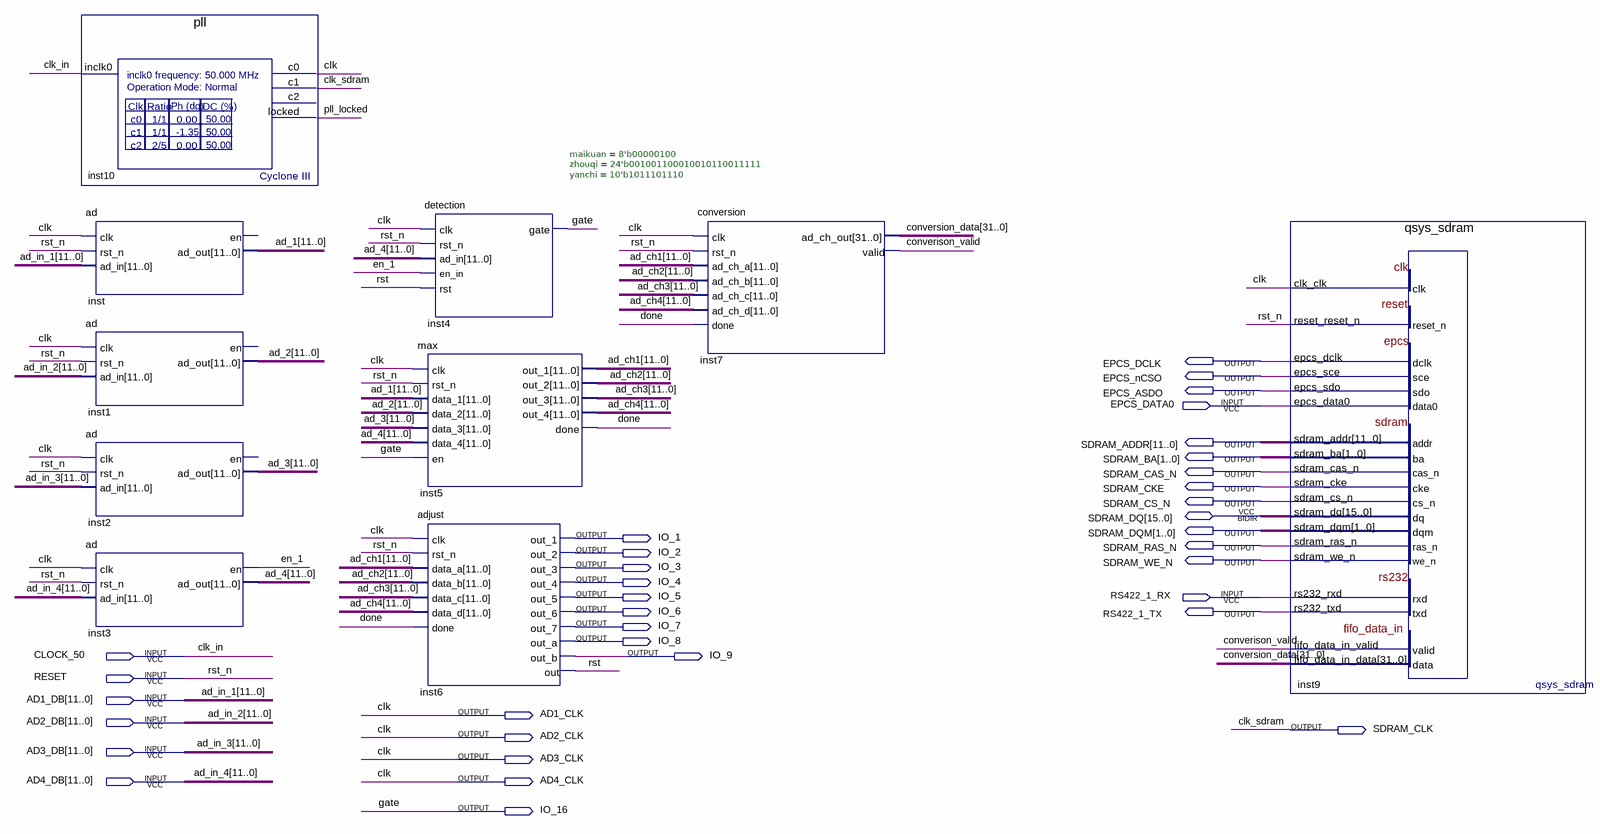
[diagram p0: schematic sheet]
// Quartus schematic ad_new.bdf as structural Verilog: 10 symbols, 36 pins
module ad_new (
  input  EPCS_DATA0,
  input  RS422_1_RX,
  input  CLOCK_50,
  input  RESET,
  input  [11:0] AD1_DB,
  input  [11:0] AD2_DB,
  input  [11:0] AD3_DB,
  input  [11:0] AD4_DB,
  inout  [15:0] SDRAM_DQ,
  output EPCS_DCLK,
  output EPCS_nCSO,
  output EPCS_ASDO,
  output [11:0] SDRAM_ADDR,
  output [1:0] SDRAM_BA,
  output SDRAM_CAS_N,
  output SDRAM_CKE,
  output SDRAM_CS_N,
  output [1:0] SDRAM_DQM,
  output IO_1,
  output SDRAM_RAS_N,
  output IO_2,
  output SDRAM_WE_N,
  output IO_3,
  output IO_4,
  output IO_5,
  output IO_6,
  output RS422_1_TX,
  output IO_7,
  output IO_8,
  output IO_9,
  output AD1_CLK,
  output SDRAM_CLK,
  output AD2_CLK,
  output AD3_CLK,
  output AD4_CLK,
  output IO_16
);

  wire converison_valid, done, en_1, pll_locked, rst;
  wire [11:0] ad_1, ad_2, ad_3, ad_4, ad_ch1, ad_ch2, ad_ch3, ad_ch4;
  wire [31:0] conversion_data;

  pll inst10 (.inclk0(CLOCK_50), .c0(AD1_CLK), .c1(SDRAM_CLK), .locked(pll_locked));  // open: c2
  ad inst (.clk(AD1_CLK), .rst_n(RESET), .ad_in(AD1_DB), .ad_out(ad_1));  // open: en
  ad inst1 (.clk(AD1_CLK), .rst_n(RESET), .ad_in(AD2_DB), .ad_out(ad_2));  // open: en
  ad inst2 (.clk(AD1_CLK), .rst_n(RESET), .ad_in(AD3_DB), .ad_out(ad_3));  // open: en
  ad inst3 (.clk(AD1_CLK), .rst_n(RESET), .ad_in(AD4_DB), .en(en_1), .ad_out(ad_4));
  max inst5 (
    .clk(AD1_CLK), .rst_n(RESET), .data_1(ad_1), .data_2(ad_2), .data_3(ad_3), .data_4(ad_4), .en(IO_16),
    .out_1(ad_ch1), .out_2(ad_ch2), .out_3(ad_ch3), .out_4(ad_ch4), .done(done));
  adjust inst6 (
    .clk(AD1_CLK), .rst_n(RESET), .data_a(ad_ch1), .data_b(ad_ch2), .data_c(ad_ch3), .data_d(ad_ch4),
    .done(done), .out_1(IO_1), .out_2(IO_2), .out_3(IO_3), .out_4(IO_4), .out_5(IO_5), .out_6(IO_6),
    .out_7(IO_7), .out_a(IO_8), .out_b(IO_9), .out(rst));
  detection #(.maikuan(8'b00000100), .zhouqi(24'b001001100010010110011111), .yanchi(10'b1011101110)) inst4 (
    .clk(AD1_CLK), .rst_n(RESET), .ad_in(ad_4), .en_in(en_1), .rst(rst), .gate(IO_16));
  conversion inst7 (
    .clk(AD1_CLK), .rst_n(RESET), .ad_ch_a(ad_ch1), .ad_ch_b(ad_ch2), .ad_ch_c(ad_ch3), .ad_ch_d(ad_ch4),
    .done(done), .ad_ch_out(conversion_data), .valid(converison_valid));
  qsys_sdram inst9 (
    .clk_clk(AD1_CLK), .reset_reset_n(RESET), .epcs_data0(EPCS_DATA0), .rs232_rxd(RS422_1_RX),
    .fifo_data_in_valid(converison_valid), .fifo_data_in_data(conversion_data), .epcs_dclk(EPCS_DCLK),
    .epcs_sce(EPCS_nCSO), .epcs_sdo(EPCS_ASDO), .sdram_addr(SDRAM_ADDR), .sdram_ba(SDRAM_BA),
    .sdram_cas_n(SDRAM_CAS_N), .sdram_cke(SDRAM_CKE), .sdram_cs_n(SDRAM_CS_N), .sdram_dqm(SDRAM_DQM),
    .sdram_ras_n(SDRAM_RAS_N), .sdram_we_n(SDRAM_WE_N), .rs232_txd(RS422_1_TX), .sdram_dq(SDRAM_DQ));

  assign AD2_CLK = AD1_CLK;
  assign AD3_CLK = AD1_CLK;
  assign AD4_CLK = AD1_CLK;

  // Other names for the same wires on the sheet: ad_in_1[11:0] = AD1_DB; ad_in_2[11:0] = AD2_DB;
  //   ad_in_3[11:0] = AD3_DB; ad_in_4[11:0] = AD4_DB; clk = AD1_CLK; clk_in = CLOCK_50; clk_sdram = SDRAM_CLK;
  //   gate = IO_16; rst_n = RESET
endmodule
